# Altium schematic sheet Schematics.SchDoc: Crane Operation Scheme
size A4; DrawnBy: Justin, Daniel Page, Sienna; DocumentNumber: 1; SheetTotal: 1; DocumentName: Assignment 2; ProjectName: Crane Operation
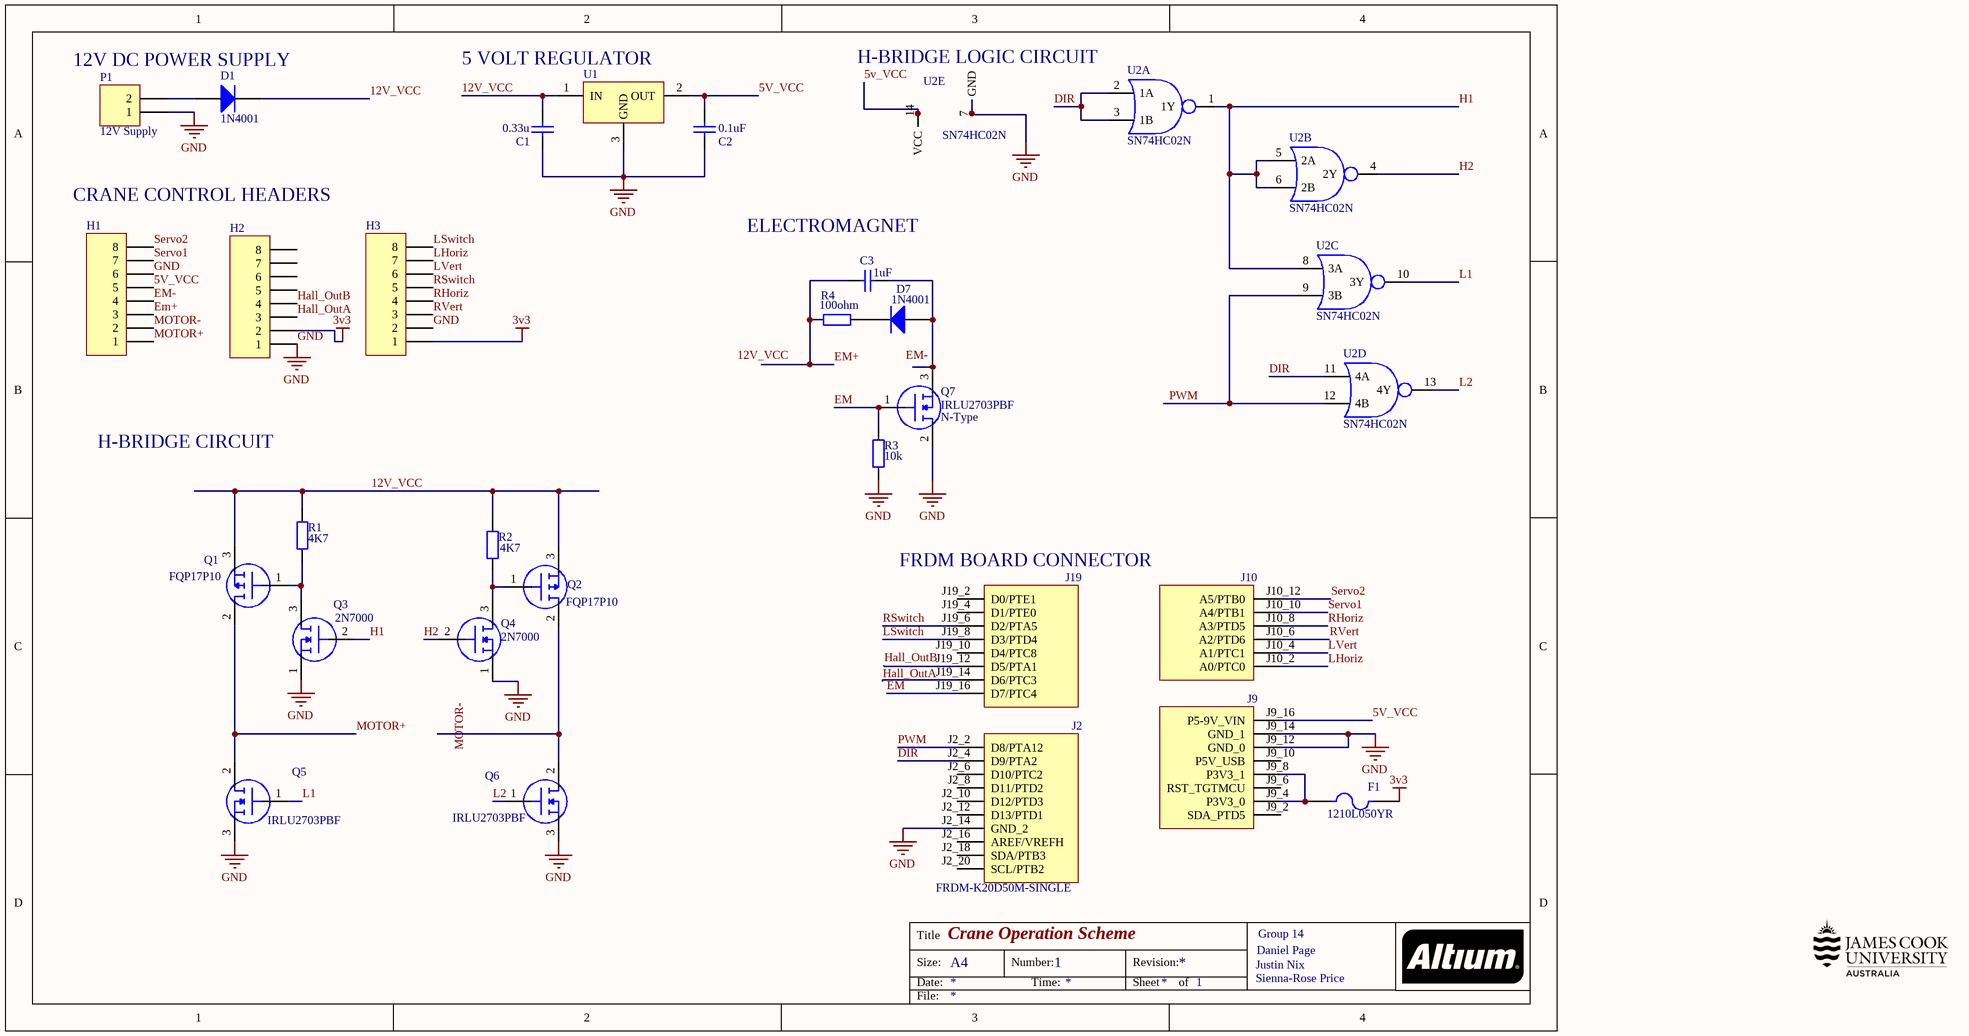
[diagram p0: Schematics.SchDoc]

## Parts
?  JCU-LOGO  [JCU-LOGO-1004]  (value not drawn)
C1  value 0.33u  [RAD-0.3]  (hidden comment: Cap)
C2  value 0.1uF  [RAD-0.3]  (hidden comment: Cap)
C3  value 1uF  [RAD-0.3]  (hidden comment: Cap)
D1  1N4001  [DO-41]
D7  1N4001  [DO-41]
F1  1210L050YR  [Fuse-1210]
FRDM?  FRDM-K20D50M-SINGLE  [FRDM-K20D50M-SINGLE]
H1  Header 8  [HDR1X8]  (value not drawn)
H2  Header 8  [HDR1X8]  (value not drawn)
H3  Header 8  [HDR1X8]  (value not drawn)
P1  12V Supply  [HDR1X2]
Q1  FQP17P10  [TO-220]
Q2  FQP17P10  [TO-220]
Q3  2N7000  [TO-92]
Q4  2N7000  [TO-92]
Q5  IRLU2703PBF  [TO-251AA]
Q6  IRLU2703PBF  [TO-251AA]
Q7  IRLU2703PBF  [TO-251AA]
R1  value 4K7  [AXIAL-0.4]  (hidden comment: Res2)
R2  value 4K7  [AXIAL-0.4]  (hidden comment: Res2)
R3  value 10k  [AXIAL-0.4]  (hidden comment: Res2)
R4  100ohm  [AXIAL-0.4]
U1  (no value)  [TO-220]
U2  SN74HC02N  [DIP14]  (parts A,B,C,D,E of 5)

## Nets
3v3: F1.2 H2.2 H3.1
GND: C1.1 C2.1 FRDM?.J2_14(GND_2) FRDM?.J9_12(GND_0) FRDM?.J9_14(GND_1) H1.6 H2.1 H3.2 P1.1 Q3.1(S) Q4.1(S) Q5.3(S) Q6.3(S) Q7.2(D) R3.1 U1.3(GND) U2.7(GND)
5V_VCC: C2.2 FRDM?.J9_16(P5-9V_VIN) H1.5 U1.2(OUT) U2.14(VCC)
12V_VCC: C1.2 D1.1 Q1.3(S) Q2.3(S) R1.2 R2.2 U1.1(IN)
DIR: FRDM?.J2_4(D9/PTA2) U2.2(1A) U2.3(1B) U2.11(4A)
EM: FRDM?.J19_16(D7/PTC4) Q7.1(G) R3.2
EM+: C3.1 H1.3 R4.2
EM-: H1.4
H1: Q3.2(G) U2.1(1Y) U2.5(2A) U2.6(2B) U2.8(3A)
H2: Q4.2(G) U2.4(2Y)
Hall_OutA: FRDM?.J19_14(D6/PTC3) H2.3
Hall_OutB: FRDM?.J19_12(D5/PTA1) H2.4
L1: Q5.1(G) U2.10(3Y)
L2: Q6.1(G) U2.13(4Y)
LHoriz: FRDM?.J10_2(A0/PTC0) H3.7
LSwitch: FRDM?.J19_8(D3/PTD4) H3.8
LVert: FRDM?.J10_4(A1/PTC1) H3.6
MOTOR+: H1.1 Q1.2(D) Q5.2(D)
MOTOR-: H1.2
PWM: FRDM?.J2_2(D8/PTA12) U2.9(3B) U2.12(4B)
RHoriz: FRDM?.J10_8(A3/PTD5) H3.4
RSwitch: FRDM?.J19_6(D2/PTA5) H3.5
RVert: FRDM?.J10_6(A2/PTD6) H3.3
Servo1: FRDM?.J10_10(A4/PTB1) H1.7
Servo2: FRDM?.J10_12(A5/PTB0) H1.8
NetC3_2: C3.2 D7.2 Q7.3(S)
NetD1_2: D1.2 P1.2
NetD7_1: D7.1 R4.1
NetF1_1: F1.1 FRDM?.J9_4(P3V3_0) FRDM?.J9_8(P3V3_1)
NetQ1_1: Q1.1(G) Q3.3(D) R1.1
NetQ2_1: Q2.1(G) Q4.3(D) R2.1
NetQ2_2: Q2.2(D) Q6.2(D)

Not connected (* = marked no-connect by the designer): FRDM? J2_6(D10/PTC2) J2_8(D11/PTD2) J2_10(D12/PTD3) J2_12(D13/PTD1) J2_16(AREF/VREFH) J2_18(SDA/PTB3) J2_20(SCL/PTB2) J9_2(SDA_PTD5) J9_6(RST_TGTMCU) J9_10(P5V_USB) J19_2(D0/PTE1) J19_4(D1/PTE0) J19_10(D4/PTC8); H2 5 6 7 8

## Notes on the sheet
- 12V DC POWER SUPPLY
- (near U1) 5 VOLT REGULATOR
- (near U2) H-BRIDGE LOGIC CIRCUIT
- CRANE CONTROL HEADERS
- (near C3) ELECTROMAGNET
- H-BRIDGE CIRCUIT
- (near Q7) N-Type
- (near FRDM?) FRDM BOARD CONNECTOR
- Justin Nix
- Sienna-Rose Price
- Daniel Page
- Group 14
- Labels drawn without touching a wire or pin: 12V_VCC, EM-, MOTOR-
- Title
- Size:
- Date:
- A4
- Number:
- Time:
- Revision:
- Sheet
- of
- File:
- (in symbol FRDM-K20D50M-SINGLE) J19; J10; J9; J2

## Library data of the parts
? = JCU-LOGO: James Cook University Logo
C1-C3 = Cap: Capacitor; Published: 8-Jun-2000; LatestRevisionDate: 17-Jul-2002; LatestRevisionNote: Re-released for DXP Platform.; PackageReference: RAD-0.3; Publisher: Altium Limited; PackageDescription: Radial Cap, Thru-Hole; 2 Leads; 0.3 in Pin Spacing
D1 D7 = 1N4001: Diode 1A 50V
F1 = 1210L050YR: Polyfuse 0.5 A 1210 Package
FRDM? = FRDM-K20D50M-SINGLE: FRDM-K20D50M SINGLE
H1-H3 = Header 8: Header, 8-Pin; LatestRevisionDate: 17-Jul-2002; LatestRevisionNote: Re-released for DXP Platform.; Publisher: Altium Limited
P1 = Header 2: Header, 2-Pin; LatestRevisionDate: 17-Jul-2002; LatestRevisionNote: Re-released for DXP Platform.; Publisher: Altium Limited
Q1 Q2 = FQP17P10: P-Channel Power MOSFET 100 V 16.5 A
Q3 Q4 = 2N7000: N-Channel Low Current MOSFET 200mA
Q5-Q7 = IRLU2703PBF: N-Channel Power MOSFET 30 V 22 A
R1-R4 = Res2: Resistor; Published: 8-Jun-2000; LatestRevisionDate: 17-Jul-2002; LatestRevisionNote: Re-released for DXP Platform.; PackageReference: AXIAL-0.4; Publisher: Altium Limited; PackageDescription: Axial Device, Thru-Hole; 2 Leads; 0.4 in Pin Spacing
U1 = L7805ABP: Precision 5V 1A Regulator; pin to pad: 2>3 3>2
U2 = SN74HC02N: Quad 2-Input NOR Gate